# EasyEDA Pro project wireless charger receiver.eprj, schematic Schematic2
Board Name: PCB2; Create Date: 2025-05-03; Page Name: P1; Project Name: wireless charger receiver; Schematic Name: Schematic2; Update Date: 2025-05-05; Company: 嘉立创EDA; Page Size: A4; Version: V1.0
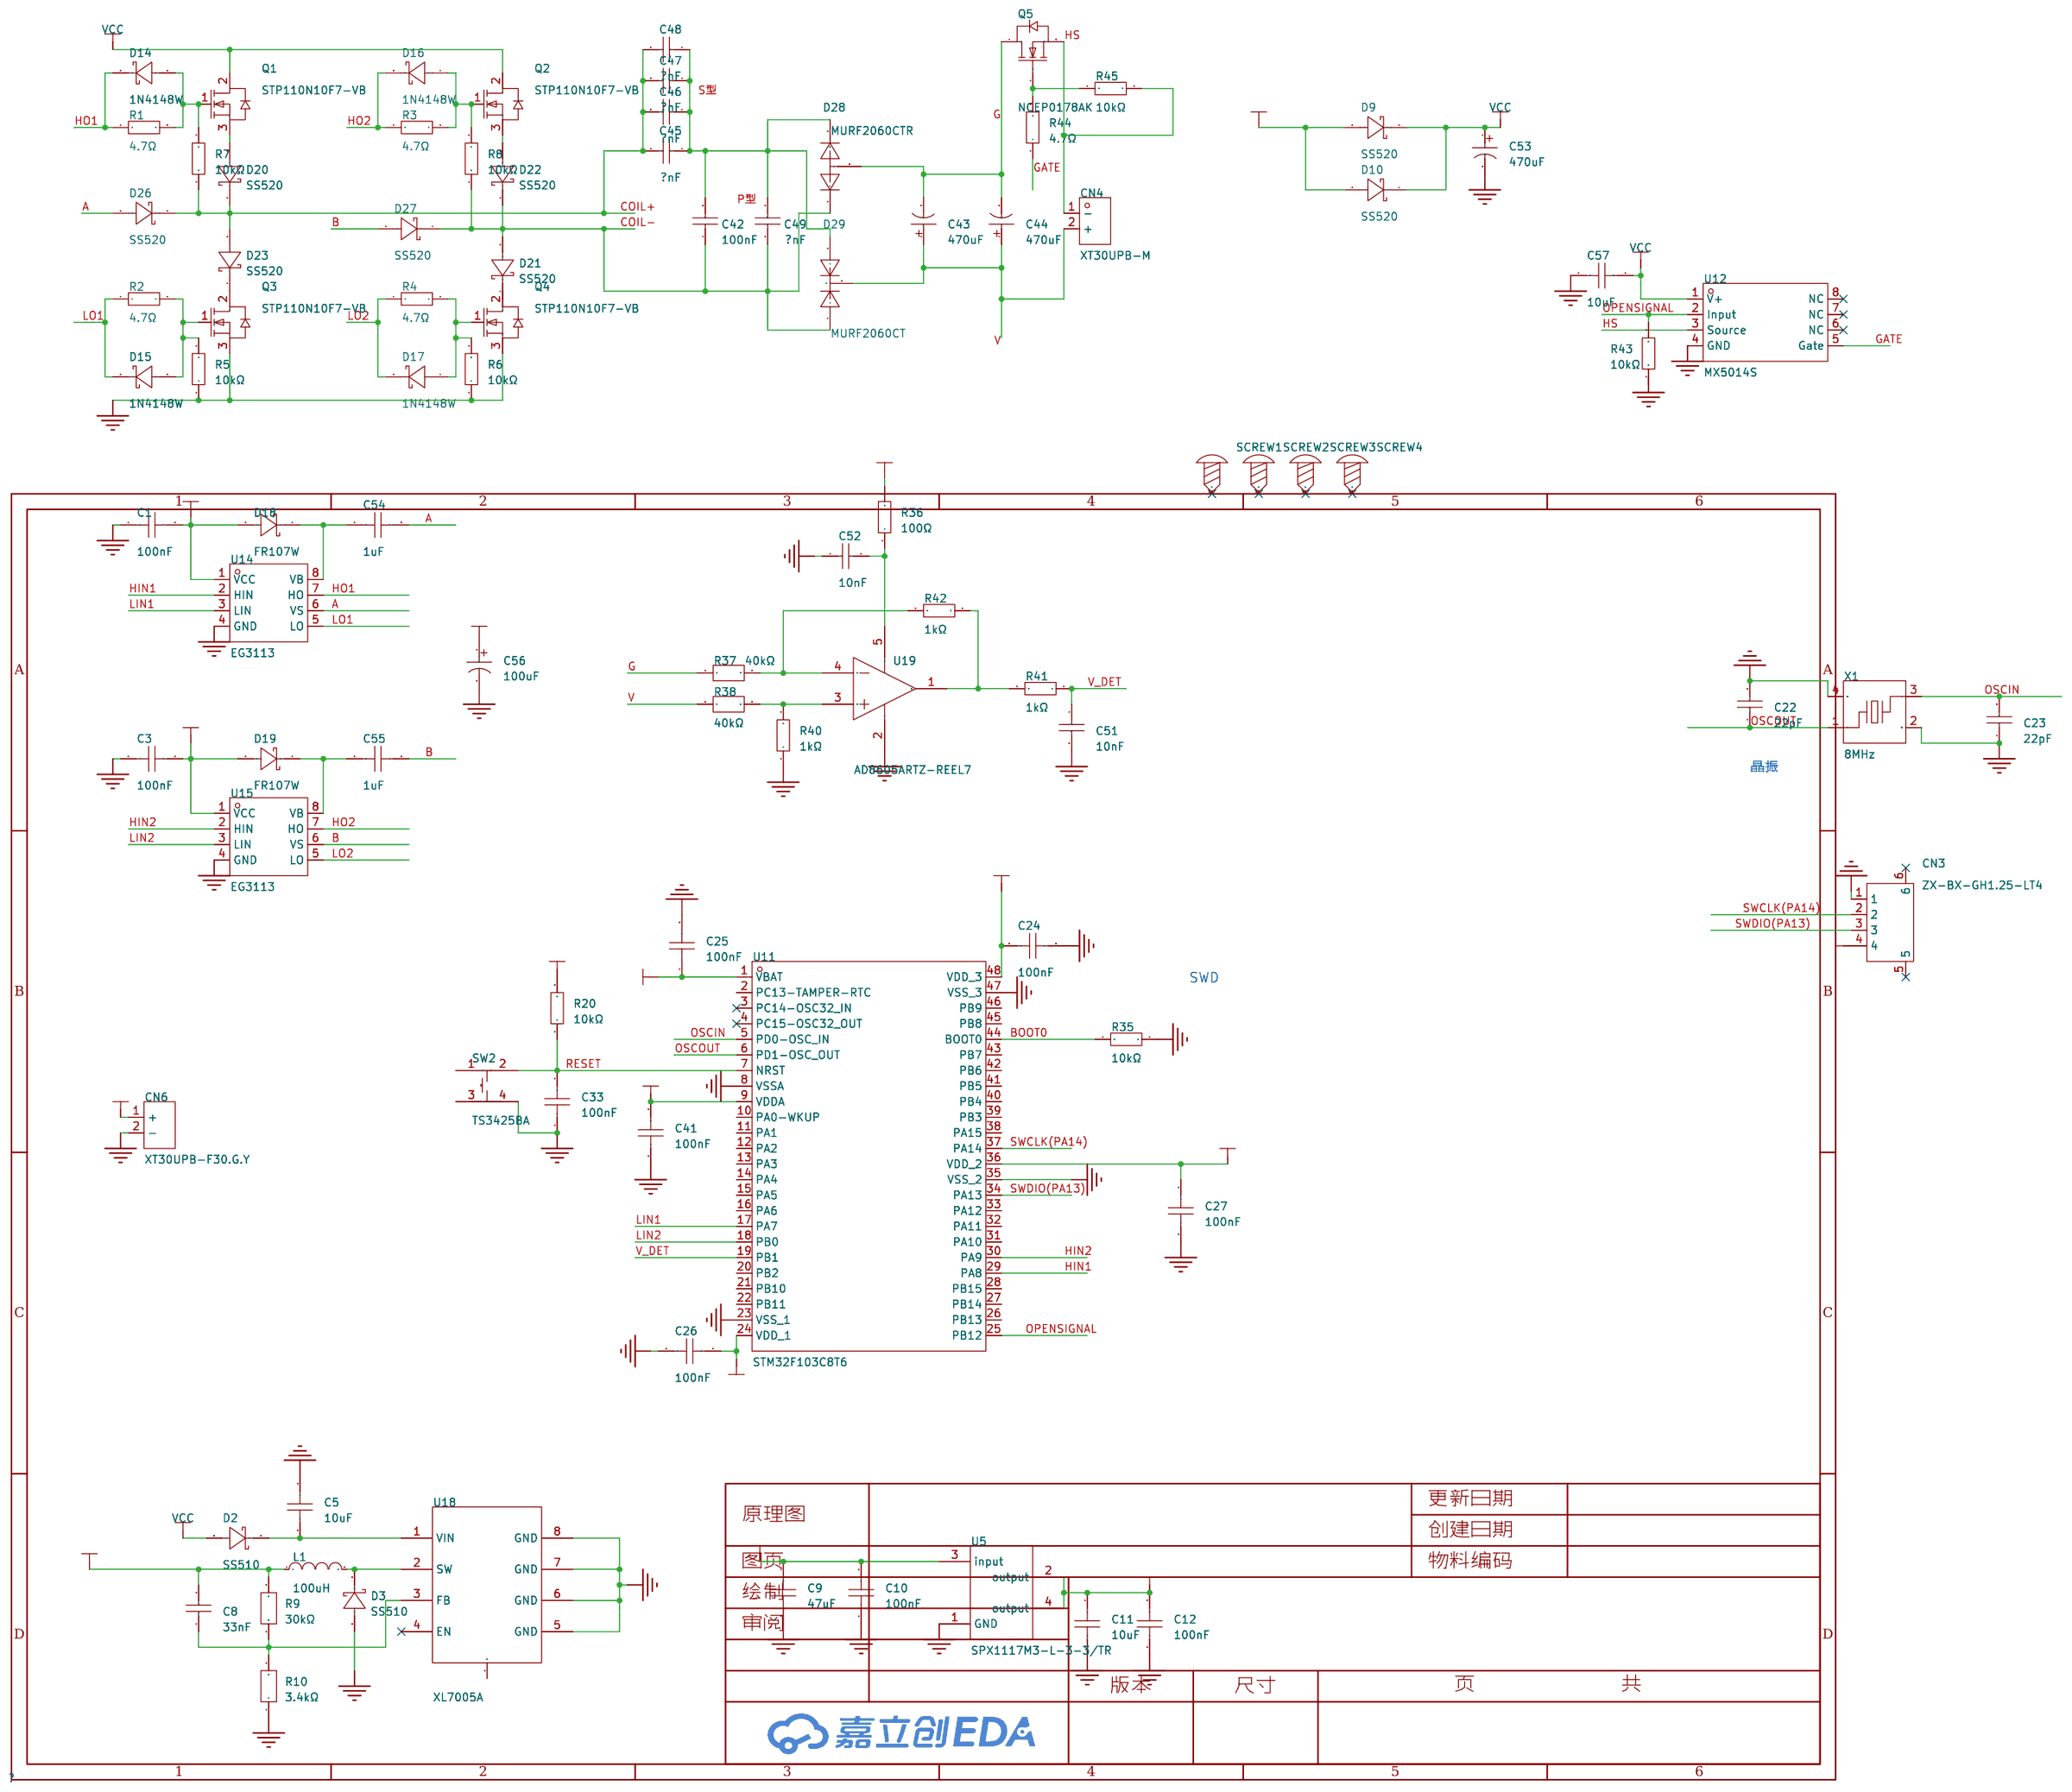
[diagram p1: schematic sheet]

## Parts
C1  100nF  [C0603]
C3  100nF  [C0603]
C5  10uF  [C1206]
C8  33nF  [C0603]
C9  47uF  [C1206]
C10  100nF  [C0603]
C11  10uF  [C0603]
C12  100nF  [C0603]
C22  22pF  [C0603]
C23  22pF  [C0603]
C24  100nF  [C0603]
C25  100nF  [C0603]
C26  100nF  [C0603]
C27  100nF  [C0603]
C33  100nF  [C0603]
C41  100nF  [C0603]
C42  100nF  [C1206]
C43  470uF  [CAP-TH_BD16.0-P7.50-D1.2-FD]
C44  470uF  [CAP-TH_BD16.0-P7.50-D1.2-FD]
C45  ？nF  [C1206]
C46  ？nF  [C1206]
C47  ？nF  [C1206]
C48  ？nF  [C1206]
C49  ？nF  [C1206]
C51  10nF  [C0603]
C52  10nF  [C0603]
C53  470uF  [CAP-TH_BD16.0-P7.50-D1.2-FD]
C54  1uF  [C1206]
C55  1uF  [C1206]
C56  100uF  [CAP-TH_BD6.3-P2.50-D1.0-FD]
C57  10uF  [C1206]
CN3  ZX-BX-GH1.25-LT4  [CONN-SMD_ZX-BX-GH1.25-LT4]
CN4  XT30UPB-M  [CONN-TH_XT30UPB-M]
CN6  XT30UPB-F30.G.Y  [CONN-TH_XT30UPB-F]
D2  SS510  [SMA_L4.3-W2.6-LS5.0-RD]
D3  SS510  [SMA_L4.3-W2.6-LS5.0-RD]
D9  SS520  [SMA_L4.3-W2.6-LS5.0-RD]
D10  SS520  [SMA_L4.3-W2.6-LS5.0-RD]
D14  1N4148W  [SOD-123_L2.7-W1.6-LS3.7-FD]
D15  1N4148W  [SOD-123_L2.7-W1.6-LS3.7-FD]
D16  1N4148W  [SOD-123_L2.7-W1.6-LS3.7-FD]
D17  1N4148W  [SOD-123_L2.7-W1.6-LS3.7-FD]
D18  FR107W  [SOD-123FL_L2.7-W1.8-LS3.8-RD]
D19  FR107W  [SOD-123FL_L2.7-W1.8-LS3.8-RD]
D20  SS520  [SMA_L4.3-W2.6-LS5.0-RD]
D21  SS520  [SMA_L4.3-W2.6-LS5.0-RD]
D22  SS520  [SMA_L4.3-W2.6-LS5.0-RD]
D23  SS520  [SMA_L4.3-W2.6-LS5.0-RD]
D26  SS520  [SMA_L4.3-W2.6-LS5.0-RD]
D27  SS520  [SMA_L4.3-W2.6-LS5.0-RD]
D28  MURF2060CTR  [TO-220F-3_L10.2-W4.7-P2.54-L]
D29  MURF2060CT  [TO-220-3_L9.9-W4.5-P2.54-L-1]
L1  100uH  [IND-SMD_L6.0-W6.0_FNR60XXS]
Q1  STP110N10F7-VB  [TO-220AB-3_L10.4-W4.6-P2.54-L]
Q2  STP110N10F7-VB  [TO-220AB-3_L10.4-W4.6-P2.54-L]
Q3  STP110N10F7-VB  [TO-220AB-3_L10.4-W4.6-P2.54-L]
Q4  STP110N10F7-VB  [TO-220AB-3_L10.4-W4.6-P2.54-L]
Q5  NCEP0178AK  [TO-252-2_L6.5-W6.1-P4.58-LS10.0-TL]
R1  4.7Ω  [R0603]
R2  4.7Ω  [R0603]
R3  4.7Ω  [R0603]
R4  4.7Ω  [R0603]
R5  10kΩ  [R0603]
R6  10kΩ  [R0603]
R7  10kΩ  [R0603]
R8  10kΩ  [R0603]
R9  30kΩ  [R0603]
R10  3.4kΩ  [R0603]
R20  10kΩ  [R0603]
R35  10kΩ  [R0603]
R36  100Ω  [R0603]
R37  40kΩ  [R0603]
R38  40kΩ  [R0603]
R40  1kΩ  [R0603]
R41  1kΩ  [R0603]
R42  1kΩ  [R0603]
R43  10kΩ  [R0603]
R44  4.7Ω  [R0603]
R45  10kΩ  [R0603]
SCREW1  -  [M3螺丝]
SCREW2  -  [M3螺丝]
SCREW3  -  [M3螺丝]
SCREW4  -  [M3螺丝]
SW2  TS3425BA  [SW-SMD_4P-L4.2-W3.2-P2.15-LS4.6-1]
U5  SPX1117M3-L-3-3/TR  [SOT-223-4_L6.5-W3.5-P2.30-LS7.0-BR]
U11  STM32F103C8T6  [LQFP-48_L7.0-W7.0-P0.50-LS9.0-BL]
U12  MX5014S  [SOIC-8_L4.9-W3.9-P1.27-LS6.0-BL]
U14  EG3113  [SOP-8_L4.9-W3.9-P1.27-LS6.0-BL]
U15  EG3113  [SOP-8_L4.9-W3.9-P1.27-LS6.0-BL]
U18  XL7005A  [SOIC-8_L4.9-W3.9-P1.27-LS6.0-BL-EP3.1-1]
U19  AD8605ARTZ-REEL7  [SOT-23-5_L3.0-W1.7-P0.95-LS2.8-BR]
X1  8MHz  [CRYSTAL-SMD_4P-L3.2-W2.5-BL]

## Library data of the parts
C1 C3 = CGA0603X7R104K500JT: LCSC Part Name: 100nF ±10% 50V; Supplier Part: C6119867; Manufacturer: HRE(芯声); Supplier Footprint: 0603; JLCPCB Part Class: 扩展库; Datasheet: https://atta.szlcsc.com/upload/public/pdf/source/20250103/C44077DA9E7B3EFAE02F22B6D3D1CBC9.pdf; Supplier: LCSC; Tolerance: ±10%; Voltage Rating: 50V; Temperature Coefficient: X7R
C5 = HGC1206R5106K500NSPJ: LCSC Part Name: 10uF ±10% 50V; Supplier Part: C7432781; Manufacturer: Chinocera(华瓷); Supplier Footprint: 1206; JLCPCB Part Class: 扩展库; Datasheet: https://atta.szlcsc.com/upload/public/pdf/source/20240320/FAC3FEC40A78BC5CCCE96C232A94D860.pdf; Supplier: LCSC; Tolerance: ±10%; Voltage Rating: 50V; Temperature Coefficient: X5R
C8 = CL10B333KB8NNNC: 容值:33nF;精度:±10%;额定电压:50V;材质(温度系数):X7R;; LCSC Part Name: 33nF ±10% 50V; Supplier Part: C21117; Manufacturer: SAMSUNG(三星); Supplier Footprint: 0603; JLCPCB Part Class: 基础库; Datasheet: https://atta.szlcsc.com/upload/public/pdf/source/20160218/1457707763339.pdf; Supplier: LCSC; Tolerance: ±10%; Voltage Rated: 50V; Temperature Coefficient: X7R
C9 = HGC1206R5476M250NSPJ: 容值:47uF;精度:±20%;额定电压:25V;材质(温度系数):X5R;; LCSC Part Name: 47uF ±20% 25V; Supplier Part: C22367835; Manufacturer: Chinocera(华瓷); Supplier Footprint: 1206; JLCPCB Part Class: 扩展库; Datasheet: https://atta.szlcsc.com/upload/public/pdf/source/20240326/E6CB0DC43BB858B74F4352229FABFDCA.pdf; Supplier: LCSC; Tolerance: ±20%; Voltage Rated: 25V; Temperature Coefficient: X5R
C10 C12 C24-C27 C33 C41 = CGA0603X7R104K500JT: LCSC Part Name: 100nF ±10% 50V; Supplier Part: C6119867; Manufacturer: HRE(芯声); Supplier Footprint: 0603; JLCPCB Part Class: 扩展库; Datasheet: https://atta.szlcsc.com/upload/public/pdf/source/20250103/C44077DA9E7B3EFAE02F22B6D3D1CBC9.pdf; Supplier: LCSC; Tolerance: ±10%; Voltage Rating: 50V; Temperature Coefficient: X7R; Voltage Rated: 50V
C11 = CGA0603X5R106K100JT: 容值:10uF;精度:±10%;额定电压:10V;材质(温度系数):X5R;; LCSC Part Name: 10uF ±10% 10V; Supplier Part: C6119842; Manufacturer: HRE(芯声); Supplier Footprint: 0603; JLCPCB Part Class: 扩展库; Supplier: LCSC; Tolerance: ±10%; Voltage Rated: 10V; Temperature Coefficient: X5R
C22 C23 = CC0603JRNPO9BN220: 容值:22pF;精度:±5%;额定电压:50V;材质(温度系数):NP0;; LCSC Part Name: 22pF ±5% 50V; Supplier Part: C105620; Manufacturer: YAGEO(国巨); Supplier Footprint: 0603; JLCPCB Part Class: 扩展库; Datasheet: https://atta.szlcsc.com/upload/public/pdf/source/20170505/1493957838062.pdf; Supplier: LCSC; Tolerance: ±5%; Voltage Rated: 50V; Temperature Coefficient: NP0
C42 C45-C49 = GRM31C5C1H104JA01L: LCSC Part Name: 100nF ±5% 50V; Supplier Part: C97946; Manufacturer: muRata(村田); Supplier Footprint: 1206; JLCPCB Part Class: 扩展库; Datasheet: https://atta.szlcsc.com/upload/public/pdf/source/20180228/C97946_15198056954501377706.pdf; Supplier: LCSC; Tolerance: ±5%; Voltage Rated: 50V; Temperature Coefficient: C0G
C43 C44 C53 = EWH1KM471L25OT: LCSC Part Name: 470uF ±20% 100V; Supplier Part: C106743; Manufacturer: AISHI(艾华集团); Supplier Footprint: 插件,D16xL25mm; JLCPCB Part Class: 扩展库; Datasheet: https://atta.szlcsc.com/upload/public/pdf/source/20200106/C481308_16D735F9103482ADD8491C667D201AFA.pdf; Supplier: LCSC; Tolerance: ±20%; Voltage Rating: 100V; Pin Spacing: 7.5mm; Diameter: 16mm; Height - Seated (Max): 25mm; Lifetime: 2000hrs@105℃
C51 C52 = CC0603KRX7R9BB103: LCSC Part Name: 10nF ±10% 50V; Supplier Part: C100042; Manufacturer: YAGEO(国巨); Supplier Footprint: 0603; JLCPCB Part Class: 扩展库; Datasheet: https://atta.szlcsc.com/upload/public/pdf/source/20181008/C309510_22F155564471FAF6A489F7D68F34234E.pdf; Supplier: LCSC; Tolerance: ±10%; Voltage Rated: 50V; Temperature Coefficient: X7R
C54 C55 = CL31B105KBHNNNE: LCSC Part Name: 1uF ±10% 50V; Supplier Part: C1848; Manufacturer: SAMSUNG(三星); Supplier Footprint: 1206; JLCPCB Part Class: 基础库; Datasheet: https://atta.szlcsc.com/upload/public/pdf/source/20160218/1457707763339.pdf; Supplier: LCSC; Tolerance: ±10%; Voltage Rated: 50V; Temperature Coefficient: X7R
C56 = ERS1VM101E12OT: LCSC Part Name: 100uF ±20% 35V; Supplier Part: C106694; Manufacturer: AISHI(艾华集团); Supplier Footprint: 插件,D6.3xL12mm; JLCPCB Part Class: 扩展库; Datasheet: https://atta.szlcsc.com/upload/public/pdf/source/20191015/C438940_4B8E60A742BB0AE40DDEF87A5C89089D.pdf; Supplier: LCSC; Tolerance: ±20%; Voltage Rating: 35V; Pin Spacing: 2.5mm; Diameter: 6.3mm; Height - Seated (Max): 12mm; Lifetime: 5000hrs@105℃
C57 = HGC1206R5106K500NSPJ: LCSC Part Name: 10uF ±10% 50V; Supplier Part: C7432781; Manufacturer: Chinocera(华瓷); Supplier Footprint: 1206; JLCPCB Part Class: 扩展库; Datasheet: https://atta.szlcsc.com/upload/public/pdf/source/20240320/FAC3FEC40A78BC5CCCE96C232A94D860.pdf; Supplier: LCSC; Tolerance: ±10%; Voltage Rating: 50V; Temperature Coefficient: X5R; Voltage Rated: 50V
CN3 = ZX-BX-GH1.25-LT4: 插针结构:1x4P;间距:1.25mm;安装方式:立贴;参考系列:GH;总PIN数:4P;排数:1;每排PIN数:4;行距:-;额定电流:-;触头材质:磷铜;触头镀层:锡;工作温度:-;; LCSC Part Name: 1x4P 间距:1.25mm 立贴 系列:GH; Supplier Part: C7429508; Manufacturer: Megastar(兆星); Supplier Footprint: SMD,P=1.25mm; JLCPCB Part Class: 扩展库; Datasheet: https://atta.szlcsc.com/upload/public/pdf/source/20230619/3EA3860FAE766B302258B62130360A2E.pdf; Supplier: LCSC; Pins Structure: 1x4P; Pitch: 1.25mm; Mounting Type: 立贴; Reference Series: GH; Number of Pins: 4P; Number of Rows: 1; Number of PINs Per Row: 4; Contact Material: 磷铜; Contact Plating: 锡; Supplementary Features: 辅助焊脚; Color: 米色; Z-Height of the Board: 4.2mm; X-Length of Bottom Edge on Board (Spacing Line): 8.25mm; Y-Width of Bottom Edge on Board: 4.25mm
CN4 = XT30UPB-M: LCSC Part Name: AMASS(艾迈斯)板载立式 航模锂电池控制器连接器插头 公头XT30UPB-M; Supplier Part: C428721; Manufacturer: AMASS(艾迈斯); JLCPCB Part Class: Extended Part; Datasheet: https://atta.szlcsc.com/upload/public/pdf/source/20230412/7B5DFEF57C9EA5273853390C734B3AC5.pdf; Supplier: LCSC; Brand: 艾迈斯; Type: 航模插头; Colour: 黄色; RatedVoltage: DC 500V; InterfaceType: 公头; MetalMaterial: 镀金; InsulationMaterial: PA; RatedCurrent: 15A; contact resistance: 0.65mΩ
CN6 = XT30UPB-F30.G.Y: LCSC Part Name: AMASS(艾迈斯)直立焊板式连接器XT30UPB30-F.G.*; Supplier Part: C108769; Manufacturer: AMASS(艾迈斯); JLCPCB Part Class: 扩展库; Datasheet: https://atta.szlcsc.com/upload/public/pdf/source/20220715/AFD68B9E8B6CA95A7295DBF4AF9325E4.pdf; Supplier: LCSC; Brand: 艾迈斯; Type: 航模插头; Colour: 黄色; RatedVoltage: DC 500V; InterfaceType: 母头; MetalMaterial: 镀金; InsulationMaterial: PA; RatedCurrent: 15A; contact resistance: 0.65mΩ
D2 D3 = SS510_C18199171: 二极管配置:独立式;正向压降(Vf):850mV@5A;直流反向耐压(Vr):100V;整流电流:5A;; LCSC Part Name: 电压:100V 电流:5A; Supplier Part: C18199171; Manufacturer: 宏迦橙; Supplier Footprint: SMA(DO-214AC); JLCPCB Part Class: 扩展库; Datasheet: https://atta.szlcsc.com/upload/public/pdf/source/20230828/254C3882F8647358AD9F60DD73611B5E.pdf; Supplier: LCSC; Diode Configuration: 独立式; Forward Voltage (Vf@If): 850mV@5A; Reverse Voltage (Vr): 100V; Rectified Current: 5A; Reverse Leakage Current (Ir): 50uA@100V
D9 D10 D20-D23 D26 D27 = SS520_C18199170: LCSC Part Name: 电压:200V 电流:5A; Supplier Part: C18199170; Manufacturer: 宏迦橙; Supplier Footprint: SMA(DO-214AC); JLCPCB Part Class: 扩展库; Datasheet: https://atta.szlcsc.com/upload/public/pdf/source/20230828/254C3882F8647358AD9F60DD73611B5E.pdf; Supplier: LCSC; Diode Configuration: 独立式; Forward Voltage (Vf@If): 950mV@5.0A; Reverse Voltage (Vr): 200V; Rectified Current: 5A; Reverse Leakage Current (Ir): 50uA@200V
D14-D17 = 1N4148W_C7420318: Supplier Part: C7420318; Manufacturer: 宏迦橙; Supplier Footprint: SOD-123; JLCPCB Part Class: 扩展库; Datasheet: https://atta.szlcsc.com/upload/public/pdf/source/20230828/E5C3F7A4272052930A7E03B75759BF50.pdf; Supplier: LCSC; Diode Configuration: 独立式; Forward Voltage (Vf@If): 1.25V@150mA; Reverse Voltage (Vr): 100V; Rectified Current: 150mA; Reverse Leakage Current (Ir): 1uA@75V; Reverse Recovery Time (trr): 4ns; Operating Temperature: -55℃~+150℃
D18 D19 = FR107W_C18199114: Supplier Part: C18199114; Manufacturer: 宏嘉诚; Supplier Footprint: SOD-123FL; JLCPCB Part Class: 扩展库; Datasheet: https://atta.szlcsc.com/upload/public/pdf/source/20250116/CFD3D02D7202F2D6A6FEE7AEEDFF5E78.pdf; Supplier: LCSC; Diode Configuration: 独立式; Voltage - Forward(Vf@If): 1.3V@1.0A; Voltage - DC Reverse(Vr): 1kV; Current - Rectified: 1A; Reverse Leakage Current (Ir): 2uA@1000V; Reverse Recovery Time (trr): 500ns; Operating Temperature: -55℃~+150℃
D28 = MURF2060CTR: Supplier Part: C22369112; Manufacturer: Wild Goose(威谷); Supplier Footprint: TO-220F; JLCPCB Part Class: 扩展库; Datasheet: https://atta.szlcsc.com/upload/public/pdf/source/20240521/F4D93C48CB68240D2A58F11026AF4A0F.pdf; Supplier: LCSC
D29 = MURF2060CT_C34373784: Supplier Part: C34373784; Manufacturer: OSEN(欧芯); Supplier Footprint: TO-220F; Datasheet: https://atta.szlcsc.com/upload/public/pdf/source/20240729/28211828F9CA7ECC5F1302E22622FCA3.pdf; Supplier: LCSC
L1 = FNR6045S101MT: 电感值:100uH;精度:±20%;额定电流:880mA;饱和电流(Isat):1A;; LCSC Part Name: 100uH ±20% 1A; Supplier Part: C168095; Manufacturer: cjiang(长江微电); Supplier Footprint: SMD,6x6mm; JLCPCB Part Class: 扩展库; Datasheet: https://atta.szlcsc.com/upload/public/pdf/source/20190327/C167925_9EFF0AABC4CA629C2CC95961DBF7D39D.pdf; Supplier: LCSC; Tolerance: ±20%; Rated Current: 880mA; Saturation Current (Isat): 1A; DC Resistance (DCR): 563mΩ
Q1-Q4 = STP110N10F7-VB: LCSC Part Name: N沟道 MOSFET,电流:120A,耐压:100V; Supplier Part: C2680810; Manufacturer: VBsemi(微碧半导体); Supplier Footprint: TO-220AB; JLCPCB Part Class: 扩展库; Datasheet: https://atta.szlcsc.com/upload/public/pdf/source/20240814/E278372EDEA89B5D587F549224534A99.pdf; Supplier: LCSC; Drain to Source Voltage: 100V; Current - Continuous Drain(Id): 120A; RDS(on): 5mΩ@10V,120A; Pd - Power Dissipation: 120W; Gate Threshold Voltage (Vgs(th)@Id): 2.5V; Gate Charge(Qg): 120nC@10V; Input Capacitance(Ciss@Vds): 10nF@50V; Reverse Transfer Capacitance (Crss@Vds): 165pF@50V; Operating Temperature: -55℃~+175℃
Q5 = NCEP0178AK: 类型:1个N沟道;漏源电压(Vdss):100V;连续漏极电流(Id):78A;导通电阻(RDS(on)):9.5mΩ@4.5V,39A;耗散功率(Pd):125W;阈值电压(Vgs(th)):1.2V;; LCSC Part Name: 1个N沟道 耐压:100V 电流:78A; Supplier Part: C216784; Manufacturer: NCE(无锡新洁能); Supplier Footprint: TO-252-2(DPAK); JLCPCB Part Class: 扩展库; Datasheet: https://atta.szlcsc.com/upload/public/pdf/source/20180614/C216784_4CC9571F208305EE00914CFFBA9F145C.pdf; Supplier: LCSC; Type: 1个N沟道; Drain to Source Voltage: 100V; Current - Continuous Drain(Id): 78A; RDS(on): 9.5mΩ@4.5V,39A; Pd - Power Dissipation: 125W; Gate Threshold Voltage (Vgs(th)@Id): 1.2V; Gate Charge(Qg): 65nC@50V; Input Capacitance(Ciss@Vds): 5.48nF@50V; Reverse Transfer Capacitance (Crss@Vds): 30pF@50V; Operating Temperature: -55℃~+175℃
R1-R4 R44 = 0603WAF470KT5E: 电阻类型:厚膜电阻;阻值:4.7Ω;精度:±1%;功率:100mW;最大工作电压:75V;温度系数:±400ppm/℃;; LCSC Part Name: 4.7Ω ±1% 100mW 厚膜电阻; Supplier Part: C23164; Manufacturer: UNI-ROYAL(厚声); Supplier Footprint: 0603; JLCPCB Part Class: 基础库; Datasheet: https://atta.szlcsc.com/upload/public/pdf/source/20200306/C422600_1E6D84923E4A46A82E41ADD87F860B5C.pdf; Supplier: LCSC; Type: 厚膜电阻; Tolerance: ±1%; Power(Watts): 100mW; Overload Voltage (Max): 75V; Temperature Coefficient: ±400ppm/℃; Operating Temperature Range: -55℃~+155℃
R5-R8 R20 R35 R43 R45 = 0603WAF1002T5E: LCSC Part Name: 厚膜电阻 10kΩ ±1% 100mW; Supplier Part: C25804; Manufacturer: UNI-ROYAL(厚声); Supplier Footprint: 0603; JLCPCB Part Class: 基础库; Datasheet: https://atta.szlcsc.com/upload/public/pdf/source/20200306/C422600_1E6D84923E4A46A82E41ADD87F860B5C.pdf; Supplier: LCSC; Type: 厚膜电阻; Tolerance: ±1%; Power(Watts): 100mW; Overload Voltage (Max): 75V; Temperature Coefficient: ±100ppm/℃; Operating Temperature Range: -55℃~+155℃
R9 = FRC0603F3002TS: 电阻类型:厚膜电阻;阻值:30kΩ;精度:±1%;功率:100mW;最大工作电压:75V;温度系数:±100ppm/℃;; LCSC Part Name: 30kΩ ±1% 100mW 厚膜电阻; Supplier Part: C2907025; Manufacturer: FOJAN(富捷); Supplier Footprint: 0603; JLCPCB Part Class: 扩展库; Datasheet: https://atta.szlcsc.com/upload/public/pdf/source/20211221/925EC7D7225764EE0046F22065062C87.pdf; Supplier: LCSC; Type: 厚膜电阻; Tolerance: ±1%; Power(Watts): 100mW; Overload Voltage (Max): 75V; Temperature Coefficient: ±100ppm/℃; Operating Temperature Range: -55℃~+155℃
R10 = FRC0603F3401TS: LCSC Part Name: 3.4kΩ ±1% 100mW 厚膜电阻; Supplier Part: C2933201; Manufacturer: FOJAN(富捷); Supplier Footprint: 0603; JLCPCB Part Class: 扩展库; Datasheet: https://atta.szlcsc.com/upload/public/pdf/source/20211221/925EC7D7225764EE0046F22065062C87.pdf; Supplier: LCSC; Type: 厚膜电阻; Tolerance: ±1%; Power(Watts): 100mW; Overload Voltage (Max): 75V; Temperature Coefficient: ±100ppm/℃; Operating Temperature Range: -55℃~+155℃
R36 = 0603WAF1000T5E: LCSC Part Name: 100Ω ±1% 100mW 厚膜电阻; Supplier Part: C22775; Manufacturer: UNI-ROYAL(厚声); Supplier Footprint: 0603; JLCPCB Part Class: 基础库; Datasheet: https://atta.szlcsc.com/upload/public/pdf/source/20200306/C422600_1E6D84923E4A46A82E41ADD87F860B5C.pdf; Supplier: LCSC; Type: 厚膜电阻; Tolerance: ±1%; Power(Watts): 100mW; Overload Voltage (Max): 75V; Temperature Coefficient: ±200ppm/℃; Operating Temperature Range: -55℃~+155℃
R37 R38 = RT0603BRD0740KL: LCSC Part Name: 薄膜电阻 40kΩ ±0.1% 100mW; Supplier Part: C861392; Manufacturer: YAGEO(国巨); Supplier Footprint: 0603; JLCPCB Part Class: 扩展库; Datasheet: https://atta.szlcsc.com/upload/public/pdf/source/20200610/C326738_5639A9F1B6EB6E4AE2197577D3456E7F.pdf; Supplier: LCSC; Type: 薄膜电阻; Tolerance: ±0.1%; Power(Watts): 100mW; Temperature Coefficient: ±25ppm/℃; Operating Temperature Range: -55℃~+155℃
R40-R42 = 0603WAF1001T5E: LCSC Part Name: 1kΩ ±1% 100mW 厚膜电阻; Supplier Part: C21190; Manufacturer: UNI-ROYAL(厚声); Supplier Footprint: 0603; JLCPCB Part Class: 基础库; Datasheet: https://atta.szlcsc.com/upload/public/pdf/source/20200306/C422600_1E6D84923E4A46A82E41ADD87F860B5C.pdf; Supplier: LCSC; Type: 厚膜电阻; Tolerance: ±1%; Power(Watts): 100mW; Overload Voltage (Max): 75V; Temperature Coefficient: ±100ppm/℃; Operating Temperature Range: -55℃~+155℃
SCREW1-SCREW4 = M3螺丝: Supplier Footprint: 插件
SW2 = TS3425BA: 电路结构:单刀单掷;按钮形状:椭圆形按钮;作用力:250gf;安装方式:立贴;开关长度:4.2mm;开关宽度:3.2mm;开关高度:2.5mm;带支架:不带;触点电流:50mA;额定电压(DC):12V;绝缘电阻:100MΩ;机械寿命:10万次;; LCSC Part Name: 4.2*3.2*2.5mm 立贴 轻触开关; Supplier Part: C2681476; Manufacturer: SHOU HAN(首韩); Supplier Footprint: SMD; JLCPCB Part Class: 扩展库; Datasheet: https://atta.szlcsc.com/upload/public/pdf/source/20210107/C2681476_BF217B2301F0070AA49504CB0BFDE895.pdf; Supplier: LCSC; Circuit: 单刀单掷; Actuator Style: 椭圆形按钮; Operating Force: 250gf; Mounting Style: 立贴; Switch Length: 4.2mm; Switch Width: 3.2mm; Switch Height: 2.5mm; Strike Gundam: 不带; Contact Current: 50mA; Voltage Rating (DC): 12V; Insulation Resistance: 100MΩ; Actuator/Cap Color: 白色; Pin Style: J型引脚; Mechanical Life: 10万次; Operating Temperature: -20℃~+85℃
U5 = SPX1117M3-L-3-3/TR: 输出类型:固定;最大输入电压:20V;输出电压:3.3V;最大输出电流:800mA;电源纹波抑制比(PSRR):70dB@(120Hz);输出极性:正极;; Supplier Part: C6862; Manufacturer: MaxLinear(迈凌); Supplier Footprint: SOT-223; JLCPCB Part Class: 扩展库; Datasheet: https://atta.szlcsc.com/upload/public/pdf/source/20161024/1477287964949.pdf; Supplier: LCSC; Output Type: 固定; Maximum Input Voltage: 20V; Output Voltage: 3.3V; MAX Output Current: 800mA; Power Supply Rejection Ratio (PSRR): 70dB@(120Hz); Dropout Voltage: 1.3V@(800mA); standby current: 10mA; Operating Temperature: -40℃~+125℃; Output Polarity: 正极; Number of Outputs: 1
U11 = STM32F103C8T6: CPU内核:ARM-M3;CPU最大主频:72MHz;应用领域:-;; LCSC Part Name: 主流增强型ARM Cortex-M3 MCU，具有64 KB Flash、72 MHz CPU、电机控制、USB和CAN; Supplier Part: C8734; Manufacturer: ST(意法半导体); Supplier Footprint: LQFP-48(7x7); JLCPCB Part Class: 扩展库; Datasheet: https://atta.szlcsc.com/upload/public/pdf/source/20220812/8363ACEC51AD55ECEB84799464F7CB85.pdf; Supplier: LCSC; CPU Core: ARM-M3; CPU Maximum Speed: 72MHz; Program Storage Size: 64KB; Program Memory Type: FLASH; Number of I/O: 37; ADC (Bit): 12bit; Low Voltage Detection Threshold: 2V~3.6V
U12 = MX5014S: 驱动配置:高边;; LCSC Part Name: 高边驱动; Supplier Part: C5359091; Manufacturer: Wuxi Maxinmicro(无锡明芯微); Supplier Footprint: SOP-8L; JLCPCB Part Class: 扩展库; Datasheet: https://atta.szlcsc.com/upload/public/pdf/source/20230209/33EE770FFA27735255664B6163A2CBF6.pdf; Supplier: LCSC; Driven Configuration: 高边
U14 U15 = EG3113: Supplier Part: C480666; Manufacturer: EG(屹晶微); Supplier Footprint: SOP-8; JLCPCB Part Class: 扩展库; Datasheet: https://atta.szlcsc.com/upload/public/pdf/source/20200107/C480666_D5544605FB4679BC12FF7DD2E4F5DF33.pdf; Supplier: LCSC
U18 = XL7005A: LCSC Part Name: 0.4A 150kHz 80V 降压型DC-DC转换器; Supplier Part: C50848; Manufacturer: XLSEMI(芯龙); Supplier Footprint: SOIC-8-EP; JLCPCB Part Class: 扩展库; Datasheet: https://atta.szlcsc.com/upload/public/pdf/source/20150821/1457707346919.pdf; Supplier: LCSC; Function: 降压型; Output Type: 可调; Input Voltage: 5V~80V; Output Voltage: 1.25V~20V; Output Current: 400mA; Switching Frequency: 150kHz; Operating Temperature: -40℃~+125℃; Number of Outputs: 1; Topology: 降压式
U19 = AD8605ARTZ-REEL7: LCSC Part Name: 精密、低噪声、轨到轨输入输出、CMOS运算放大器（双路）; Supplier Part: C9641; Manufacturer: ADI(亚德诺); Supplier Footprint: SOT-23-5; JLCPCB Part Class: 扩展库; Datasheet: https://atta.szlcsc.com/upload/public/pdf/source/20121029/1457706543879.pdf; Supplier: LCSC; Number of Circuits: 单路; Gain Bandwidth Product(GBP): 10MHz; Current - Input Bias(Ib): 0.2pA; Slew Rate(SR): 5V/us; Output Current: 80mA; Operating Temperature: -40℃~+125℃
X1 = X32258MOB4SI: 晶振类型:贴片晶振;频率:8MHz;常温频差:±10ppm;负载电容:12pF;频率稳定度:±20ppm;; LCSC Part Name: 8MHz ±10ppm 12pF; Supplier Part: C2682775; Manufacturer: YXC(扬兴晶振); Supplier Footprint: SMD3225-4P; JLCPCB Part Class: 扩展库; Datasheet: https://atta.szlcsc.com/upload/public/pdf/source/20240329/19D5F850207469550BEB00D7DFEDBC7A.pdf; Supplier: LCSC; Type: 贴片晶振; Normal temperature Frequency Tolerance: ±10ppm; Load Capacitance: 12pF; Frequency Stability: ±20ppm; Equivalent Series Resistance(ESR): 150Ω; Operating Temperature: -40℃~+85℃

## Nets
+3.3V: C11.1 C12.2 C24.1 C25.1 C26.1 C27.1 C41.2 CN3.4 R20.2 R36.2 U5.2(output) U5.4(output) U11.1(VBAT) U11.9(VDDA) U11.24(VDD_1) U11.36(VDD_2) U11.48(VDD_3)
+12V: C1.2 C3.2 C8.2 C9.2 C10.2 C56.1 D18.2(A) D19.2(A) L1.1 R9.2 U5.3(input) U14.1(VCC) U15.1(VCC)
GND: C1.1 C3.1 C5.2 C9.1 C10.1 C11.2 C12.1 C22.2 C23.1 C24.2 C25.2 C26.2 C27.2 C33.1 C41.1 C51.2 C52.1 C53.2 C56.2 C57.1 CN3.1 CN6.2(-) D3.2(A) Q3.3(S) Q4.3(S) R5.1 R6.1 R10.1 R35.2 R40.1 R43.1 SW2.4 U5.1(GND) U11.8(VSSA) U11.23(VSS_1) U11.35(VSS_2) U11.47(VSS_3) U12.4(GND) U14.4(GND) U15.4(GND) U18.5(GND) U18.6(GND) U18.7(GND) U18.8(GND) U19.2(-V) X1.2(GND) X1.4(GND)
VCC: C53.1 C57.2 D2.2(A) D9.1(K) D10.1(K) Q1.2(D) Q2.2(D) U12.1(V+)
A: C54.2 D26.2(A) U14.6(VS)
B: C55.2 D27.2(A) U15.6(VS)
BOOT0: R35.1 U11.44(BOOT0)
COIL+: C45.2 C46.2 C47.2 C48.2 D20.1(K) D23.2(A) D26.1(K) R7.1
COIL-: C42.1 C49.2 D21.2(A) D22.1(K) D27.1(K) D28.1 D29.1(A) R8.1
G: C43.2 C44.2 D28.2 Q5.4(D) R37.1
GATE: R44.1 U12.5(Gate)
HIN1: U11.29(PA8) U14.2(HIN)
HIN2: U11.30(PA9) U15.2(HIN)
HO1: D14.2(K) R1.1 U14.7(HO)
HO2: D16.2(K) R3.1 U15.7(HO)
HS: CN4.1(-) Q5.3(S) R45.2 U12.3(Source)
LIN1: U11.17(PA7) U14.3(LIN)
LIN2: U11.18(PB0) U15.3(LIN)
LO1: D15.2(K) R2.1 U14.5(LO)
LO2: D17.2(K) R4.1 U15.5(LO)
OPENSIGNAL: R43.2 U11.25(PB12) U12.2(Input)
OSCIN: C23.2 U11.5(PD0-OSC_IN) X1.3
OSCOUT: C22.1 U11.6(PD1-OSC_OUT) X1.1
RESET: C33.2 R20.1 SW2.2 U11.7(NRST)
SWCLK(PA14): CN3.2 U11.37(PA14)
SWDIO(PA13): CN3.3 U11.34(PA13)
V: C43.1 C44.1 CN4.2(+) D29.2 R38.1
V_DET: C51.1 R41.1 U11.19(PB1)
VREF: CN6.1(+) D9.2(A) D10.2(A)
$1N4138: D14.1(A) Q1.1(G) R1.2 R7.2
$1N4143: D15.1(A) Q3.1(G) R2.2 R5.2
$1N4144: D16.1(A) Q2.1(G) R3.2 R8.2
$1N4149: D17.1(A) Q4.1(G) R4.2 R6.2
$1N4159: C54.1 D18.1(K) U14.8(VB)
$1N4175: C55.1 D19.1(K) U15.8(VB)
$1N4184: D20.2(A) Q1.3(S)
$1N4185: D21.1(K) Q4.2(D)
$1N4186: D22.2(A) Q2.3(S)
$1N4191: C8.1 R9.1 R10.2 U18.3(FB)
$1N4266: C42.2 C45.1 C46.1 C47.1 C48.1 C49.1 D28.3 D29.3(A)
$1N4309: R38.2 R40.2 U19.3(+IN)
$1N4317: C52.2 R36.1 U19.5(+V)
$1N4321: R37.2 R42.2 U19.4(-IN)
$1N4326: R41.2 R42.1 U19.1(OUT)
$1N4341: C5.1 D2.1(K) U18.1(VIN)
$1N4344: D3.1(K) L1.2 U18.2(SW)
$1N4547: D23.1(K) Q3.2(D)
$1N17930: Q5.1(G) R44.2 R45.1

Not connected (* = marked no-connect by the designer): CN3 5* 6*; SCREW1 1*; SCREW2 1*; SCREW3 1*; SCREW4 1*; SW2 1 3; U11 2(PC13-TAMPER-RTC) 3(PC14-OSC32_IN)* 4(PC15-OSC32_OUT)* 10(PA0-WKUP) 11(PA1) 12(PA2) 13(PA3) 14(PA4) 15(PA5) 16(PA6) 20(PB2) 21(PB10) 22(PB11) 26(PB13) 27(PB14) 28(PB15) 31(PA10) 32(PA11) 33(PA12) 38(PA15) 39(PB3) 40(PB4) 41(PB5) 42(PB6) 43(PB7) 45(PB8) 46(PB9); U12 6(NC)* 7(NC)* 8(NC)*; U18 4(EN)* 9

## Notes on the sheet
- S型
- P型
- 晶振
- SWD
